# EAGLE design Spectra6PCB_93 (EAGLE 9.6.2)
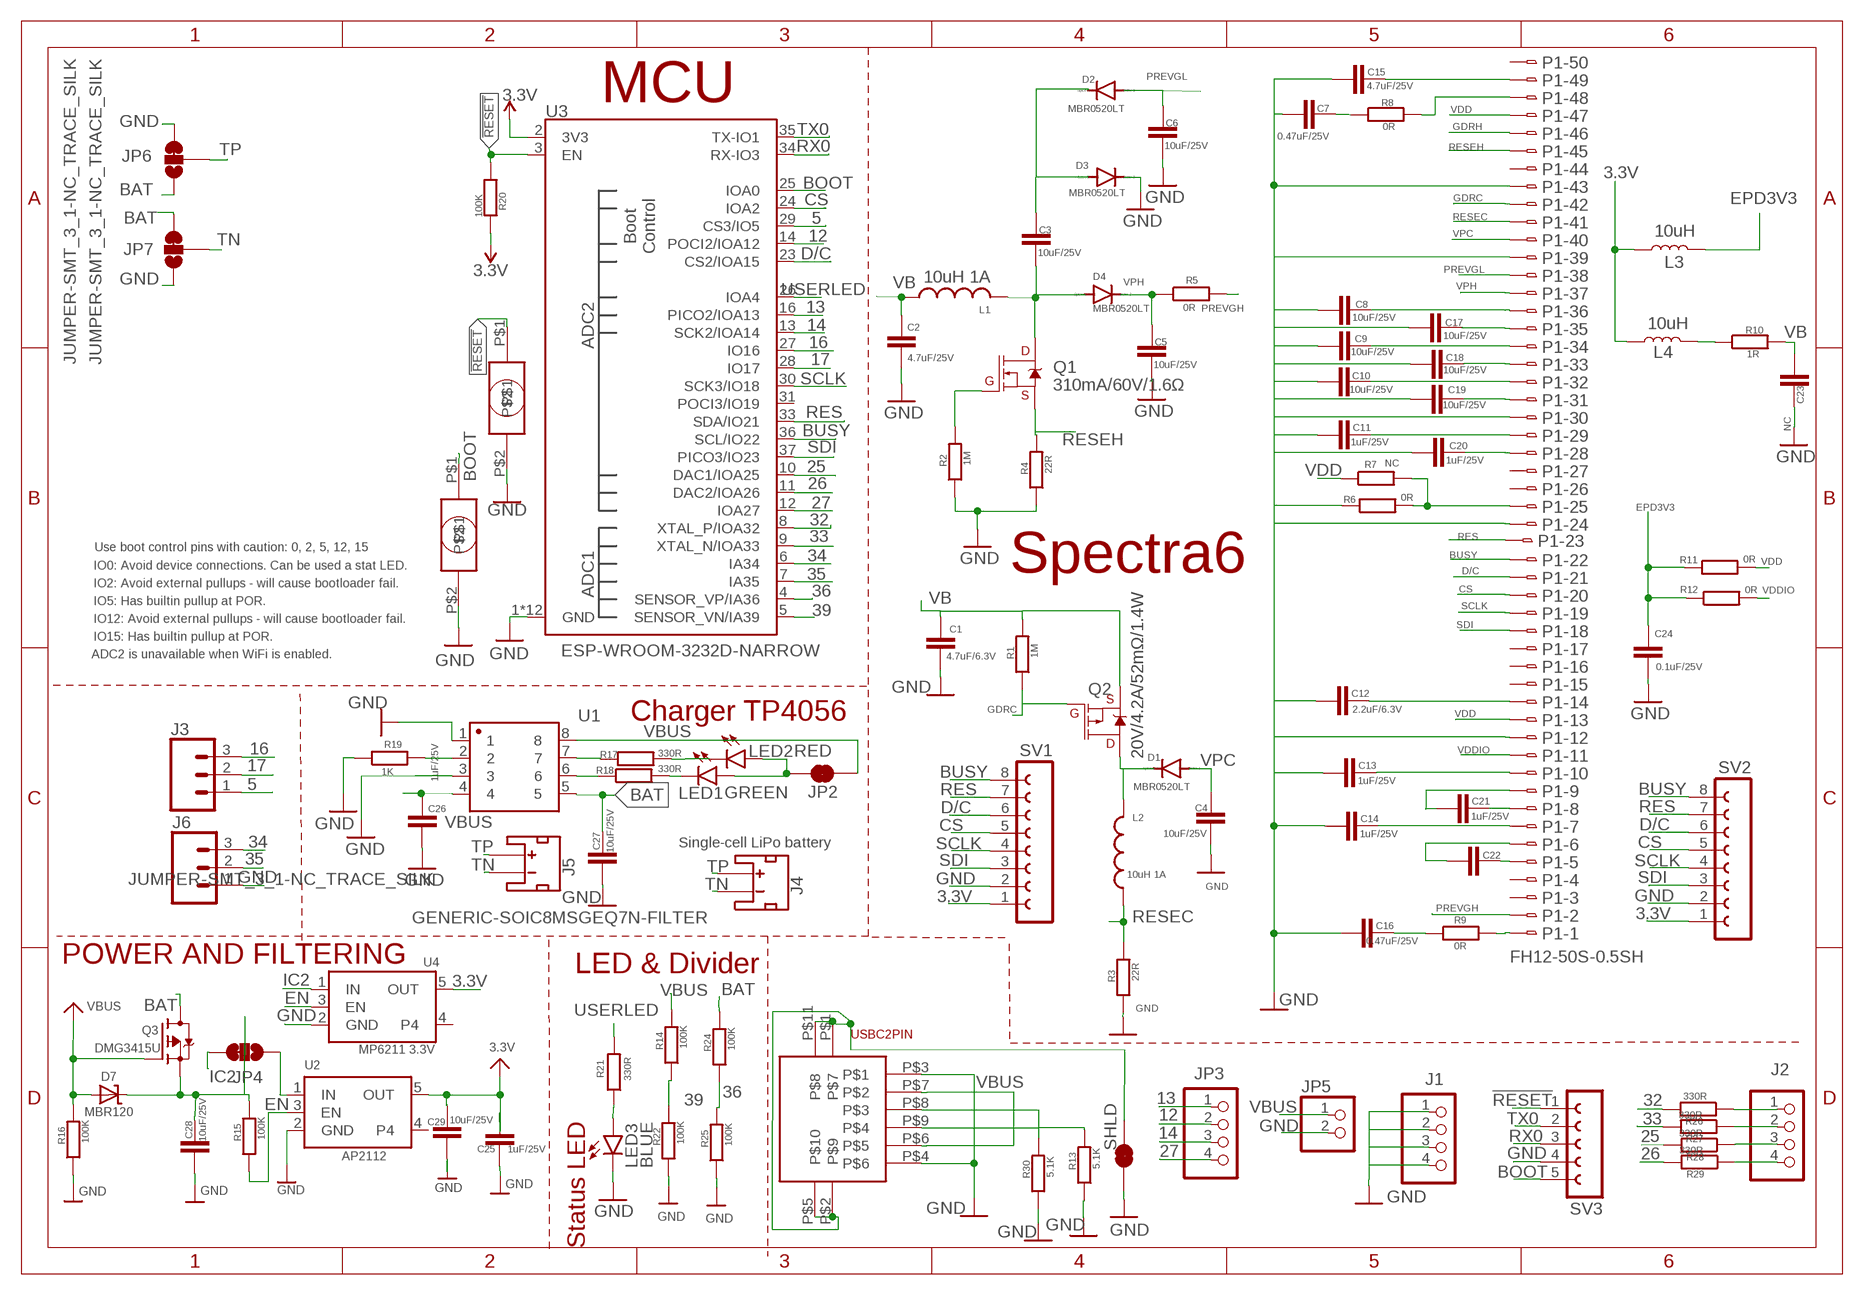
[diagram p0: schematic, sheet 1]

## Parts
C1  4.7uF/6.3V  C-EUC0805  [C0805]
C2  4.7uF/25V  C-EUC0805  [C0805]
C3  10uF/25V  C-EUC0805  [C0805]
C4  10uF/25V  C-EUC0805  [C0805]
C5  10uF/25V  C-EUC0805  [C0805]
C6  10uF/25V  C-EUC0805  [C0805]
C7  0.47uF/25V  C-EUC0805  [C0805]
C8  10uF/25V  C-EUC0805  [C0805]
C9  10uF/25V  C-EUC0805  [C0805]
C10  10uF/25V  C-EUC0805  [C0805]
C11  1uF/25V  C-EUC0805  [C0805]
C12  2.2uF/6.3V  C-EUC0805  [C0805]
C13  1uF/25V  C-EUC0805  [C0805]
C14  1uF/25V  C-EUC0805  [C0805]
C15  4.7uF/25V  C-EUC0805  [C0805]
C16  0.47uF/25V  C-EUC0805  [C0805]
C17  10uF/25V  C-EUC0805  [C0805]
C18  10uF/25V  C-EUC0805  [C0805]
C19  10uF/25V  C-EUC0805  [C0805]
C20  1uF/25V  C-EUC0805  [C0805]
C21  1uF/25V  C-EUC0805  [C0805]
C22  1uF/25V  C-EUC0805  [C0805]
C23  NC  C-EUC0805  [C0805]
C24  0.1uF/25V  C-EUC0805  [C0805]
C25  1uF/25V  C-EUC0805  [C0805]
C26  1uF/25V  C-EUC0805  [C0805]
C27  10uF/25V  C-EUC0805  [C0805]
C28  10uF/25V  C-EUC0805  [C0805]
C29  10uF/25V  C-EUC0805  [C0805]
D1  MBR0520LT  [SOD123]
D2  MBR0520LT  [SOD123]
D3  MBR0520LT  [SOD123]
D4  MBR0520LT  [SOD123]
D7  MBR120  DIODE-SCHOTTKYSOD-123  [SOD-123]
J1  PINHD-1X4  [1X04]
J2  PINHD-1X4  [1X04]
J3  CONN_03PAD  [1X03_SOLDER_PADS]
J4  JST_2MM_MALE  [JST-2-SMD]
J5  NC  JST_2MM_MALE  [JST-2-SMD]
J6  CONN_03PAD  [1X03_SOLDER_PADS]
JP2  JUMPER-SMT_2_NC_TRACE_SILK  [SMT-JUMPER_2_NC_TRACE_SILK]
JP3  PINHD-1X4  [1X04]
JP4  JUMPER-SMT_3_1-NC_TRACE_SILK  [SMT-JUMPER_3_1-NC_TRACE_SILK]
JP5  PINHD-1X2  [1X02]
JP6  JUMPER-SMT_3_1-NC_TRACE_SILK  [SMT-JUMPER_3_1-NC_TRACE_SILK]
JP7  JUMPER-SMT_3_1-NC_TRACE_SILK  [SMT-JUMPER_3_1-NC_TRACE_SILK]
L1  10uH 1A  L-USL4035M  [L4035M]
L2  10uH 1A  L-USL4035M  [L4035M]
L3  10uH  INDUCTOR-0805-3.3UH  [0805]
L4  10uH  INDUCTOR-0805-3.3UH  [0805]
LED1  GREEN  LEDSML0805  [SML0805]
LED2  RED  LEDSML0805  [SML0805]
LED3  BLUE  LEDSML0805  [SML0805]
P1  FH12-50S-0.5SH  [FH12-50S-0.5SH]
Q1  310mA/60V/1.6Ω  MOSFET-NCH-2N7002PW  [SOT323]
Q2  20V/4.2A/52mΩ/1.4W  MOSFET_PCH-DMG2305UX-7  [SOT23-3]
Q3  DMG3415U  MOSFET-P  [SOT23-R]
R1  1M  R-EU_M0805  [M0805]
R2  1M  R-EU_M0805  [M0805]
R3  22R  R-EU_M0805  [M0805]
R4  22R  R-EU_M0805  [M0805]
R5  0R  R-EU_M0805  [M0805]
R6  0R  R-EU_M0805  [M0805]
R7  NC  R-EU_M0805  [M0805]
R8  0R  R-EU_M0805  [M0805]
R9  0R  R-EU_M0805  [M0805]
R10  1R  R-EU_M0805  [M0805]
R11  0R  R-EU_M0805  [M0805]
R12  0R  R-EU_M0805  [M0805]
R13  5.1K  R-EU_M0805  [M0805]
R14  100K  R-EU_M0805  [M0805]
R15  100K  R-EU_M0805  [M0805]
R16  100K  R-EU_M0805  [M0805]
R17  330R  R-EU_M0805  [M0805]
R18  330R  R-EU_M0805  [M0805]
R19  1K  R-EU_M0805  [M0805]
R20  100K  R-EU_M0805  [M0805]
R21  330R  R-EU_M0805  [M0805]
R22  100K  R-EU_M0805  [M0805]
R24  100K  R-EU_M0805  [M0805]
R25  100K  R-EU_M0805  [M0805]
R26  330R  R-EU_M0805  [M0805]
R27  330R  R-EU_M0805  [M0805]
R28  330R  R-EU_M0805  [M0805]
R29  330R  R-EU_M0805  [M0805]
R30  5.1K  R-EU_M0805  [M0805]
S3  TACTILE  [TACTILE]
S4  TACTILE  [TACTILE]
SHLD  SHLD  JUMPER-SMT_2_NC_TRACE_NO-SILK  [SMT-JUMPER_2_NC_TRACE_NO-SILK]
SV1  FE08-1  [FE08]
SV2  FE08-1  [FE08]
SV3  FE05-1  [FE05-1]
U1  GENERIC-SOIC8MSGEQ7N-FILTER  [SO08]
U2  AP2112  VREG_SOT23-5  [SOT23-5]
U3  ESP-WROOM-3232D-NARROW  [ESP-WROOM-32D-NARROW]
U4  MP6211 3.3V  VREG_SOT23-5  [SOT23-5]
U$4  USBC6PIN  [USBC6PIN]

## Nets
3.3V: C25.2 C29.2 L3.1 L4.1 R20.2 SV1.1 SV2.1 U2.5(OUT) U3.2(3V3) U4.5(OUT)
5: J3.1 U3.29(CS3/IO5)
12: JP3.2 U3.14(POCI2/IOA12)
13: JP3.1 U3.16(PICO2/IOA13)
14: JP3.3 U3.13(SCK2/IOA14)
16: J3.3 U3.27(IO16)
17: J3.2 U3.28(IO17)
25: R28.2 U3.10(DAC1/IOA25)
26: R29.2 U3.11(DAC2/IOA26)
27: JP3.4 U3.12(IOA27)
32: R26.2 U3.8(XTAL_P/IOA32)
33: R27.2 U3.9(XTAL_N/IOA33)
34: J6.3 U3.6(IA34)
35: J6.2 U3.7(IA35)
36: R24.1 R25.2 U3.4(SENSOR_VP/IA36)
39: R14.1 R22.2 U3.5(SENSOR_VN/IA39)
!RESET!: R20.1 S4.P$1 SV3.1 U3.3(EN)
BAT: C27.2 JP6.1 JP7.3 Q3.3(D) R24.2 U1.5
BOOT: S3.P$1 SV3.5 U3.25(IOA0)
BUSY: P1.22 SV1.8 SV2.8 U3.36(SCL/IO22)
CS: P1.20 SV1.5 SV2.5 U3.24(IOA2)
D/C: P1.21 SV1.6 SV2.6 U3.23(CS2/IOA15)
EN: R15.1 U2.3(EN) U4.3(EN)
EPD3V3: C24.2 L3.2 R11.1 R12.1
GDRC: P1.42 Q2.1(G) R1.1
GDRH: P1.46 Q1.1(G) R2.2
GND: C1.1 C2.1 C4.1 C5.2 C6.2 C7.1 C8.1 C9.1 C10.1 C11.1 C12.1 C13.1 C14.1 C15.1 C16.1 C17.1 C18.1 C19.1 C20.1 C23.2 C24.1 C25.1 C26.1 C27.1 C28.1 C29.1 D3.C J1.1 J1.2 J1.3 J1.4 J6.1 JP5.2 JP6.3 JP7.1 LED3.C P1.24 P1.30 P1.39 P1.43 R2.1 R3.1 R4.1 R6.1 R13.1 R16.1 R19.1 R22.1 R25.1 R30.1 S3.P$2 S4.P$2 SHLD.1 SV1.2 SV2.2 SV3.4 U1.1 U1.3 U2.2(GND) U3.1(GND) U3.15(GND) U3.38(GND) U3.GND1(GND) U3.GNDT1(GND) U3.GNDT2(GND) U3.GNDT3(GND) U3.GNDT4(GND) U3.GNDT5(GND) U3.GNDT6(GND) U3.GNDT7(GND) U3.GNDT8(GND) U4.2(GND) U$4.P$3 U$4.P$4
IC2: JP4.3 U4.1(IN)
LED1: LED2.C R17.2
LED2: LED1.C R18.2
N$1: C15.2 P1.49
N$2: P1.48 R8.2
N$3: C7.2 R8.1
N$4: L4.2 R10.1
N$5: C8.2 P1.36
N$6: C17.2 P1.35
N$7: C9.2 P1.34
N$8: C18.2 P1.33
N$9: C10.2 P1.32
N$10: C19.2 P1.31
N$12: C11.2 P1.29
N$13: C20.2 P1.28
N$14: P1.25 R6.2 R7.2
N$15: JP2.2 LED1.A LED2.A
N$16: C12.2 P1.14
N$17: C13.2 P1.10
N$18: C21.1 P1.9
N$19: C21.2 P1.8
N$20: C14.2 P1.7
N$21: C22.1 P1.6
N$22: C22.2 P1.5
N$23: P1.1 R9.2
N$24: C16.2 R9.1
N$25: C3.2 D4.A L1.2 Q1.3(D)
N$26: C3.1 D2.C D3.A
N$28: J2.1 R26.1
N$29: P1.12
N$30: J2.2 R27.1
N$31: D1.C L2.2 Q2.3(D)
N$32: J2.3 R28.1
N$33: C1.2 Q2.2(S) R1.2
N$34: R19.2 U1.2
N$35: JP4.1 U2.1(IN)
N$36: C28.2 D7.C JP4.2 Q3.2(S) R15.2
N$37: R18.1 U1.6
N$38: R17.1 U1.7
N$39: LED3.A R21.1
N$40: J2.4 R29.1
N$41: R13.2 U$4.P$9
N$42: R30.2 U$4.P$8
PREVGH: P1.2 R5.2
PREVGL: C6.1 D2.A P1.38
RES: P1.23 SV1.7 SV2.7 U3.33(SDA/IO21)
RESEC: L2.1 P1.41 R3.2
RESEH: P1.45 Q1.2(S) R4.2
RX0: SV3.3 U3.34(RX-IO3)
SCLK: P1.19 SV1.4 SV2.4 U3.30(SCK3/IO18)
SDI: P1.18 SV1.3 SV2.3 U3.37(PICO3/IO23)
SHLD: SHLD.2 U$4.P$1 U$4.P$2 U$4.P$5 U$4.P$11
TN: J4.1(-) J5.1(-) JP7.2
TP: J4.2(+) J5.2(+) JP6.2
TX0: SV3.2 U3.35(TX-IO1)
USERLED: R21.2 U3.26(IOA4)
VB: C2.2 C23.1 L1.1 R10.2
VBUS: C26.2 D7.A JP2.1 JP5.1 Q3.1(G) R14.2 R16.2 U1.4 U1.8 U$4.P$6 U$4.P$7
VDD: P1.13 P1.47 R7.1 R11.2
VDDIO: P1.11 R12.2
VPC: C4.2 D1.A P1.40
VPH: C5.1 D4.C P1.37 R5.1
Unconnected: J4.NC1(PAD1) J4.NC2(PAD2) J5.NC1(PAD1) J5.NC2(PAD2) P1.3 P1.4 P1.15 P1.16 P1.17 P1.26 P1.27 P1.44 P1.50 U2.4 U3.31(POCI3/IO19) U4.4

## Notes on the sheet
- MCU
- Use boot control pins with caution: 0, 2, 5, 12, 15
- IO0: Avoid device connections. Can be used a stat LED.
- Spectra6
- IO2: Avoid external pullups - will cause bootloader fail.
- IO5: Has builtin pullup at POR.
- IO12: Avoid external pullups - will cause bootloader fail.
- IO15: Has builtin pullup at POR.
- ADC2 is unavailable when WiFi is enabled.
- Charger TP4056
- Single-cell LiPo battery
- POWER AND FILTERING
- LED & Divider
- Status LED

## Library data of the parts
C1-C29 = rcl:C-EU: CAPACITOR, European symbol; SPICEPREFIX: C
D1-D4 = diode:MBR0520LT: SCHOTTKY BARRIER RECTIFIER Source: http://onsemi.com .. MBR0520LT1-D.pdf
D7 = microbuilder:DIODE-SCHOTTKY
J1 J2 JP3 = pinhead:PINHD-1X4: PIN HEADER
J3 J6 = SparkFun-Connectors:CONN_03: Multi connection point. Often used as Generic Header-pin footprint for 0.1 inch spaced/style header connections On any of the 0.1 inch spaced packages, you can populate with these: Break Away Headers - Straight <https://www.sparkfun.com/products/116> (PRT-00116) Break Away Male Headers - Right Angle <https://www.sparkfun.com/products/553> (PRT-00553) Female Headers <https://www.sparkfun.com/products/115> (PRT-00115) Break Away Headers - Machine Pin <https://www.sparkfun.com/products/117> (PRT-00117) Break Away Female Headers - Swiss Machine Pin <https://www.sparkfun.com/products/743> (PRT-00743) Stackable Header - 3 Pin (Female, 0.1") <https://www.sparkfun.com/products/13875> (PRT-13875) For SCREWTERMINALS and SPRING TERMINALS visit here: Screw Terimnals on SparkFun.com <https://www.sparkfun.com/search/results?term=Screw+Terminals> (5mm/3.5mm/2.54mm spacing) This device is also useful as a general connection point to wire up your design to another part of your project. Our various solder wires solder well into these plated through hole pads. Hook-Up Wire - Assortment (Stranded, 22 AWG) <https://www.sparkfun.com/products/11375> (PRT-11375) Hook-Up Wire - Assortment (Solid Core, 22 AWG) <https://www.sparkfun.com/products/11367> (PRT-11367) View the entire wire category on our website here <https://www.sparkfun.com/categories/141> Special notes: Molex polarized connector foot print use with SKU : PRT-08232 with associated crimp pins and housings.
J4 J5 = SparkFun-Connectors:JST_2MM_MALE: JST 2MM MALE RA CONNECTOR Two pin, compact surface mount connector. Commonly used as a battery input connection point. We really like the solid locking feeling and high current rating on these small connectors. We use these all the time as battery connectors. Mates to single-cell LiPo batteries. Here is the connector we sell at SparkFun: JST Right Angle Connector - White <https://www.sparkfun.com/products/8612> (PRT-08612) Datasheet <http://www.sparkfun.com/datasheets/Prototyping/Connectors/JST-Horizontal.pdf> It was used on these SparkFun products: SparkFun MOSFET Power Controller <https://www.sparkfun.com/products/11214> (PRT-11214) SparkFun Battery Babysitter - LiPo Battery Manager <https://www.sparkfun.com/products/13777> (PRT-13777) And many, many others that required a lipo battery connection.; PROD_ID: CONN-11443; SF_ID: PRT-08612
JP2 SHLD = SparkFun-Jumpers:JUMPER-SMT_2_NC_TRACE: Normally closed trace jumper This jumper has a trace between two pads so it's normally closed (NC). Use a razor knife to open the connection. For best results follow the IPC guidelines for cutting traces: Cutout at least 0.063 mm (0.005 in). Remove all loose material to clean up the cut area. Seal the cut with an approved epoxy. Reapply solder to reclose the connection.
JP4 JP6 JP7 = SparkFun-Jumpers:JUMPER-SMT_3_1-NC_TRACE: Normally closed trace jumper (1 of 2 connections) This jumper has a trace between two pads so it's normally closed (NC). The other connection is normally open (NO). Use a razor knife to open the connection. For best results follow the IPC guidelines for cutting traces: Cutout at least 0.063 mm (0.005 in). Remove all loose material to clean up the cut area. Seal the cut with an approved epoxy. Reapply solder to reclose the connection, or to close the NO connection.
JP5 = pinhead:PINHD-1X2: PIN HEADER
L1 L2 = rcl:L-US: INDUCTOR, American symbol; SPICEPREFIX: L
L3 L4 = SparkFun-Coils:INDUCTOR: Inductors Resist changes in electrical current. Basically a coil of wire. SparkFun Products: SparkFun Load Cell Amplifier - HX711 <https://www.sparkfun.com/products/13879> IOIO-OTG - V2.2 <https://www.sparkfun.com/products/13613>; PROD_ID: NDUC-13076; VALUE: 3.3µH/±20%/450mA
LED1-LED3 = led:LED: LED OSRAM: - CHIPLED LG R971, LG N971, LY N971, LG Q971, LY Q971, LO R971, LY R971 LH N974, LH R974 LS Q976, LO Q976, LY Q976 LO Q996 - Hyper CHIPLED LW Q18S LB Q993, LB Q99A, LB R99A - SideLED LS A670, LO A670, LY A670, LG A670, LP A670 LB A673, LV A673, LT A673, LW A673 LH A674 LY A675 LS A676, LA A676, LO A676, LY A676, LW A676 LS A679, LY A679, LG A679 - Hyper Micro SIDELED® LS Y876, LA Y876, LO Y876, LY Y876 LT Y87S - SmartLED LW L88C, LW L88S LB L89C, LB L89S, LG L890 LS L89K, LO L89K, LY L89K LS L896, LA L896, LO L896, LY L896 - TOPLED LS T670, LO T670, LY T670, LG T670, LP T670 LSG T670, LSP T670, LSY T670, LOP T670, LYG T670 LG T671, LOG T671, LSG T671 LB T673, LV T673, LT T673, LW T673 LH T674 LS T676, LA T676, LO T676, LY T676, LB T676, LH T676, LSB T676, LW T676 LB T67C, LV T67C, LT T67C, LS T67K, LO T67K, LY T67K, LW E67C LS E67B, LA E67B, LO E67B, LY E67B, LB E67C, LV E67C, LT E67C LW T67C LS T679, LY T679, LG T679 LS T770, LO T770, LY T770, LG T770, LP T770 LB T773, LV T773, LT T773, LW T773 LH T774 LS E675, LA E675, LY E675, LS T675 LS T776, LA T776, LO T776, LY T776, LB T776 LHGB T686 LT T68C, LB T68C - Hyper Mini TOPLED® LB M676 - Mini TOPLED Santana® LG M470 LS M47K, LO M47K, LY M47K Source: http://www.osram.convergy.de LUXEON: - LUMILED® LXK2-PW12-R00, LXK2-PW12-S00, LXK2-PW14-U00, LXK2-PW14-V00 LXK2-PM12-R00, LXK2-PM12-S00, LXK2-PM14-U00 LXK2-PE12-Q00, LXK2-PE12-R00, LXK2-PE12-S00, LXK2-PE14-T00, LXK2-PE14-U00 LXK2-PB12-K00, LXK2-PB12-L00, LXK2-PB12-M00, LXK2-PB14-N00, LXK2-PB14-P00, LXK2-PB14-Q00 LXK2-PR12-L00, LXK2-PR12-M00, LXK2-PR14-Q00, LXK2-PR14-R00 LXK2-PD12-Q00, LXK2-PD12-R00, LXK2-PD12-S00 LXK2-PH12-R00, LXK2-PH12-S00 LXK2-PL12-P00, LXK2-PL12-Q00, LXK2-PL12-R00 Source: www.luxeon.com KINGBRIGHT: KA-3528ASYC Source: www.kingbright.com
P1 = con-hirose:FH12-50S-0.5S: 0.5mm Pitch Connectors For FPC/FFC Source: Data sheet <http://www.hirose.co.jp/cataloge_hp/e58605370.pdf>; MPN: FH12-50S-0.5SH(55); OC_FARNELL: 1324557; OC_NEWARK: 34M6181
Q1 = SparkFun-DiscreteSemi:MOSFET-NCH: N-channel MOSFETs Voltage controlled devices that allow control of high current outputs. SparkFun Products: SparkFun OpenScale <https://www.sparkfun.com/products/13261> SparkFun Digital Sandbox <https://www.sparkfun.com/products/12651> SparkFun Monster Moto Shield <https://www.sparkfun.com/products/10182> SparkFun MOSFET Power Controller <https://www.sparkfun.com/products/11214>; PROD_ID: TRANS-11151
Q2 = SparkFun-DiscreteSemi:MOSFET_PCH: P-channel MOSFETs Voltage controlled devices that allow control of high current outputs. SparkFun Products: SparkFun ESP32 Thing <https://www.sparkfun.com/products/13907> SparkFun ESP8266 Thing <https://www.sparkfun.com/products/13231> SparkFun Pi Servo HAT V2 <https://www.sparkfun.com/products/15316> DMG2305UX-7 (20V/4.2A/SOT23-3); PROD_ID: TRANS-14388
Q3 = microbuilder:MOSFET-P: P-Channel Mosfet LEGEND VDS: Voltage Drain-Source ID: Drain Current RDS(ON): Drain-Source On-State Resistance VGS(TH): Gate-Source Threshold Voltage CISS: Drain-Source Input Capacitance SOT-23 Name VDS ID RDS(ON) VGS(TH) CISS Order Number IRLML5103 30V 760mA 600 mOhm -- 75pF @ 25V Digikey: IRLML5103PBFCT-ND IRLML6401 12V 4.3A 50 mOhm 950mV @ 250µA 830pF @ 10V Digikey: IRLML6401PBFTR-ND NTR0202PL 20V 400mA 800 mOhm 2.3V @ 250uA 70pF @ 5V Digikey: NTR0202PLT1GOSTR-ND NTR4101PT1G 20V 1.8A 85 mOhm 1.2V @ 250uA 675pF @ 10V Digikey: NTR4101PT1GOSCT-ND DMP2004K 20V 600mA 900 mOhm 1V @ 250uA 175pF @ 16V Digikey: DMP2004KDICT-ND PMV65XP 20V 3.9A 76 mOhm 950mV @ 1mA 725pF @ 20V Digikey: 568-2358-2-ND TO-252 Name VDS ID RDS(ON) VGS(TH) CISS Order Number AOD417 30V 25A 34 mOhm 3V @ 250µA 920pF @ 15V Digikey: 785-1106-2-ND PowerPak Name VDS ID RDS(ON) VGS(TH) CISS Order Number AON7401 30V 12A 14 mOhm 3V @ 250µA 2600pF @ 15V Digikey: 785-1302-1-ND
R1-R22 R24-R30 = rcl:R-EU_: RESISTOR, European symbol; SPICEPREFIX: R
S3 S4 = TACTILE1:TACTILE
SV1 SV2 = con-lsta:FE08-1: FEMALE HEADER; OC_FARNELL: unknown; OC_NEWARK: unknown
SV3 = con-lsta:FE05-1: FEMALE HEADER; OC_FARNELL: unknown; OC_NEWARK: unknown
U1 = SparkFun-Retired:GENERIC-SOIC8: A placeholder for generic narrow & wide SOIC8 foorptints - used on the DIP adapter board. Has strange reference to IC-10141, a Seven Band Graphic Equalizer Display Filter SOIC-8 VFP: IC-10141; PROD_ID: IC-10141
U2 U4 = microbuilder:VREG_SOT23-5: SOT23-5 Fixed Voltage Regulators Part Current Out V Out V In V Dropout θJA (°C/W) TJ (°C) Digikey Part No. ADP121 150mA 3.3V 3.4-5.5V 0.09V @ 150mA -- -- ADP121-AUJZ33R7CT-ND ADP121 150mA 3.0V 3.1-5.5V 0.09V @ 150mA -- -- ADP121-AUJZ30R7CT-ND ADP122 300mA 3.3V 3.4-5.5V 0.085V @ 300mA -- -- ADP122AUJZ-3.3-R7CT-ND ADP1712 300mA 3.3V 3.5-5.5V 0.17V @ 300mA -- -- ADP1712AUJZ-3.3-R7TR-ND AP7311 (Low Cost) 150mA 3.3V 3.5-6V 0.15V @ 150mA -- -- AP7311-33WG-7DICT-ND LD39015M18R 150mA 1.8V 1.9V-5.5V 0.08V @ 100mA -- -- 497-6977-1-ND LP2985A-33DBVR 150mA 3.3V 3.3-16V 0.28V @ 150mA 206 150 296-18479-1-ND MCP1824T-3302E/OT 300mA 3.3V 3.5V-6V 0.2V @ 300mA -- -- MCP1824T-3302E/OTCT-ND MIC5205-2.5YM5 TR 150mA 2.5V 2.7-16V 0.165V @ 150mA -- -- 576-1257-2-ND MIC5205-3.0YM5 TR 150mA 3.0V 3.2V-16V 0.165V @ 150mA -- -- 576-1258-2-ND MIC5205-3.3YM5 TR 150mA 3.3V 3.5V-16V 0.165V @ 150mA -- -- 576-1259-2-ND TPS780330220 150mA 3.3V+2.2V 3.6-5.5V 250mV Max -- -- 296-23332-1-ND TDA3663/N1,135 100mA 3.3V 3.5-45V 0.18V @ 50mA -- -- 568-5343-1-ND Max operating temp can be calculated using θJA, TJ (max junction temperature), and power in watts. Set the "Maximum Ambient Temperature" until it reaches TJ ("Max Junction Temperature"), which is the absolute limit for safe use of the regulator: Heat Sink Temperature Calculator <http://www.daycounter.com/Calculators/Heat-Sink-Temperature-Calculator.phtml> For example, With 12V source into a 3.3V LP2985 and a 30mA load, we are dissipating (12V-3.3V) * 0.03A = 0.261W. With a θJA of 206 °C/W, a TJ of 150°C, and 261mW we can safely use the chip without a heat sink up to 75°C (=147.1°C Junction Temperature).
U3 = SparkFun-RF:ESP-WROOM-32: ESP-WROOM-32D - trace antenna (includes keepout) ESP-WROOM-32U - U.FL antenna connector Includes both "standard" footprints and "narrow" version (for use with tighter layouts).; PROD_ID: IC-15676
U$4 = USBC6PIN2:USBC6PIN

## Net classes
0 default: width 0.127 mm, drill 0.305 mm
1 power: width 0.305 mm, drill 0.305 mm

## Board
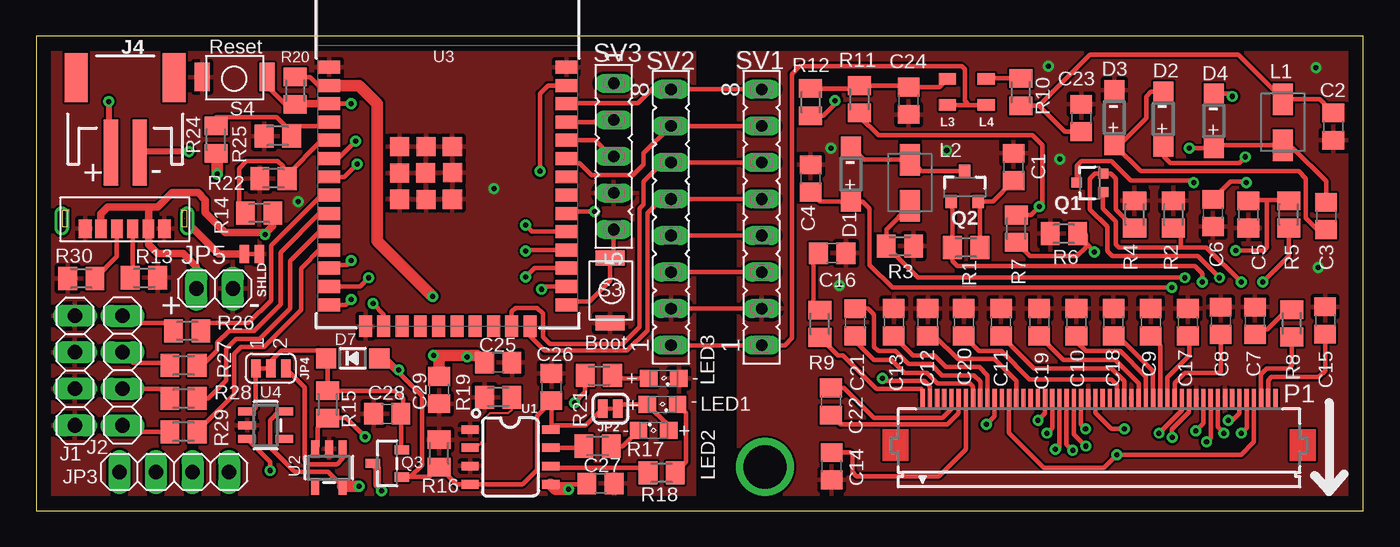
[diagram p1: board, top side]
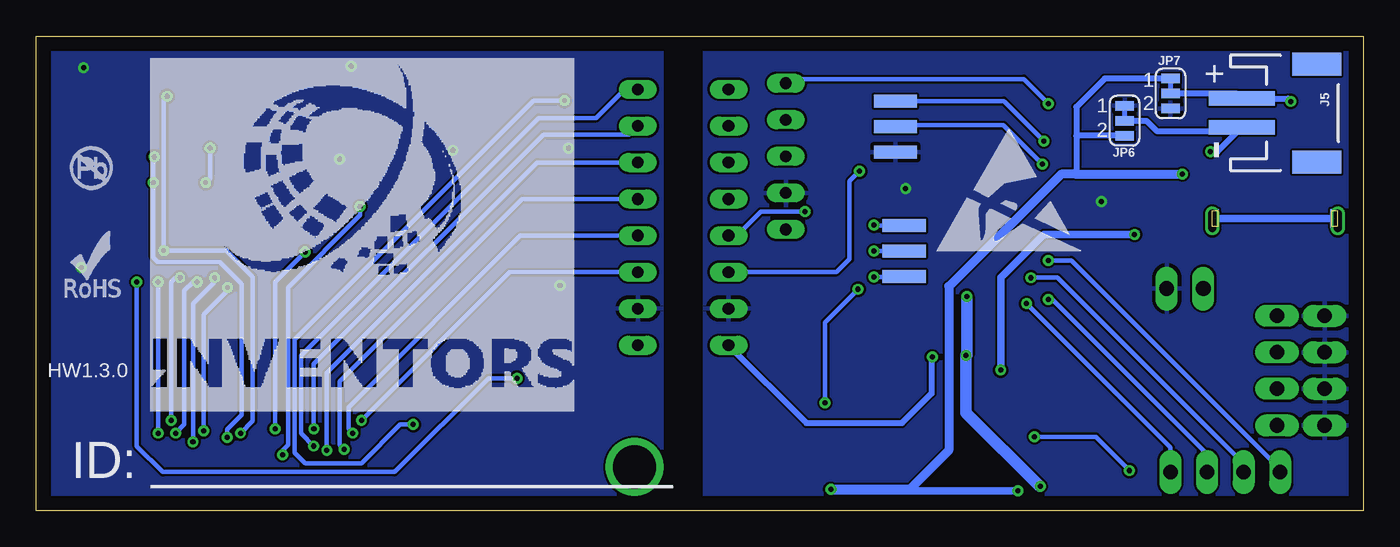
[diagram p2: board, bottom side, seen from below]

Size 92.2 x 33 mm. Coordinates in mm from the lower left corner, seen from the top.
Outline: 0,0 92.2,0 92.2,33 0,33 0,0
Copper layers (1*16): Top 0.035mm / dielectric 1.5mm / Bottom 0.035mm
Design rules "default *": minimum track width 6mil, minimum drill 0.35mm, track to track 6mil, track to pad 6mil, pad to pad 6mil, via to via 6mil, smd to smd 6mil, copper to edge 40mil, drill to drill 6mil, minimum pad ring 10mil, minimum via ring 8mil, stop-mask expansion 4mil, vias tented up to drill 0mil, thermal gap 10mil

### Footprints (pad centres in the part's own frame; a part is rotated, then mirrored left to right if it is on the bottom)
C0805 = smd 1.3 x 1.5: 1 -0.95,0; 2 0.95,0
SOD123 = smd 1.4 x 1.4: A 1.9,0; C -1.9,0
SOD-123 = smd 1.4 x 1.4: A 1.85,0; C -1.85,0
1X04 = drill 1.016 long: 1 -3.81,0; 2 -1.27,0; 3 1.27,0; 4 3.81,0
1X03_SOLDER_PADS = smd 3 x 0.9: 1 0,1.778; 2 0,0; 3 0,-1.778
JST-2-SMD = smd 1 x 4.6: 1 -1,-3.7; 2 1,-3.7 | smd 1.6 x 3.4: NC1 -3.4,1.5; NC2 3.4,1.5
SMT-JUMPER_2_NC_TRACE_SILK = smd 0.66 x 1.27: 1 -0.521,0; 2 0.521,0
SMT-JUMPER_3_1-NC_TRACE_SILK = smd 0.66 x 1.27: 1 -1.041,0; 2 0,0; 3 1.041,0
1X02 = drill 1.016 long: 1 -1.27,0; 2 1.27,0
L4035M = smd 2.2 x 1.4: 1 -1.6,0; 2 1.6,0
0805 = smd 0.8 x 1.2: 1 -0.9,0; 2 0.9,0
SML0805 = smd 1.2 x 1.2: A 1.05,0; C -1.05,0
FH12-50S-0.5SH = smd 0.3 x 1.3: 1 -12.25,3.25; 2 -11.75,3.25; 3 -11.25,3.25; 4 -10.75,3.25; 5 -10.25,3.25; 6 -9.75,3.25; 7 -9.25,3.25; 8 -8.75,3.25; 9 -8.25,3.25; 10 -7.75,3.25; 11 -7.25,3.25; 12 -6.75,3.25; 13 -6.25,3.25; 14 -5.75,3.25; 15 -5.25,3.25; 16 -4.75,3.25; 17 -4.25,3.25; 18 -3.75,3.25; 19 -3.25,3.25; 20 -2.75,3.25; 21 -2.25,3.25; 22 -1.75,3.25; 23 -1.25,3.25; 24 -0.75,3.25; 25 -0.25,3.25; 26 0.25,3.25; 27 0.75,3.25; 28 1.25,3.25; 29 1.75,3.25; 30 2.25,3.25; 31 2.75,3.25; 32 3.25,3.25; 33 3.75,3.25; 34 4.25,3.25; 35 4.75,3.25; 36 5.25,3.25; 37 5.75,3.25; 38 6.25,3.25; 39 6.75,3.25; 40 7.25,3.25; 41 7.75,3.25; 42 8.25,3.25; 43 8.75,3.25; 44 9.25,3.25; 45 9.75,3.25; 46 10.25,3.25; 47 10.75,3.25; 48 11.25,3.25; 49 11.75,3.25; 50 12.25,3.25
SOT323 = smd 0.7 x 0.7: 1 -0.65,-0.925; 2 0.65,-0.925; 3 0,0.925
SOT23-3 = smd 0.8 x 0.9: 1 -0.95,-1; 2 0.95,-1; 3 0,1.1
SOT23-R = smd 0.635 x 1.016: 1 -0.95,-1; 2 0.95,-1; 3 0,1
M0805 = smd 1.3 x 1.6: 1 -0.95,0; 2 0.95,0
TACTILE = smd 1.05 x 2: P$1 0,0; P$2 4.5,0
SMT-JUMPER_2_NC_TRACE_NO-SILK = smd 0.66 x 1.27: 1 -0.521,0; 2 0.521,0
FE08 = drill 0.813 long: 1 -8.89,0; 2 -6.35,0; 3 -3.81,0; 4 -1.27,0; 5 1.27,0; 6 3.81,0; 7 6.35,0; 8 8.89,0
FE05-1 = drill 0.813 long: 1 -5.08,0; 2 -2.54,0; 3 0,0; 4 2.54,0; 5 5.08,0
SO08 = smd 0.6 x 1.2: 1 -1.905,-2.8; 2 -0.635,-2.8; 3 0.635,-2.8; 4 1.905,-2.8; 5 1.905,2.8; 6 0.635,2.8; 7 -0.635,2.8; 8 -1.905,2.8
SOT23-5 = smd 0.55 x 1.2: 1 -0.95,-1.3; 2 0,-1.3; 3 0.95,-1.3; 4 0.95,1.3; 5 -0.95,1.3
ESP-WROOM-32D-NARROW = smd 0.9 x 1.5: 1 6.43,8.238; 2 5.16,8.238; 3 3.89,8.238; 4 2.62,8.238; 5 1.35,8.238; 6 0.08,8.238; 7 -1.19,8.238; 8 -2.46,8.238; 9 -3.73,8.238; 10 -5,8.238; 11 -6.27,8.238; 12 -7.54,8.238; 13 -8.81,8.238; 14 -10.08,8.238; 25 -10.08,-8.238; 26 -8.81,-8.238; 27 -7.54,-8.238; 28 -6.27,-8.238; 29 -5,-8.238; 30 -3.73,-8.238; 31 -2.46,-8.238; 32 -1.19,-8.238; 33 0.08,-8.238; 34 1.35,-8.238; 35 2.62,-8.238; 36 3.89,-8.238; 37 5.16,-8.238; 38 6.43,-8.238 | smd 1.5 x 0.9: 15 -11.57,5.715; 16 -11.57,4.445; 17 -11.57,3.175; 18 -11.57,1.905; 19 -11.57,0.635; 20 -11.57,-0.635; 21 -11.57,-1.905; 22 -11.57,-3.175; 23 -11.57,-4.445; 24 -11.57,-5.715 | smd 1.33 x 1.33: GND1 -0.912,1.531; GNDT1 -2.751,3.346; GNDT2 -2.761,1.516; GNDT3 -2.751,-0.314; GNDT4 -0.891,-0.324; GNDT5 0.909,-0.314; GNDT6 0.909,1.516; GNDT7 0.909,3.346; GNDT8 -0.921,3.346
USBC6PIN = smd 0.55 x 1.3: P$1 8.65,1.45; P$2 0.35,1.45 | smd 0.89 x 1.3: P$3 7.25,2.15; P$4 1.75,2.15 | smd 0.55 x 1.3 bottom: P$5 0.35,1.45; P$11 8.65,1.45 | smd 0.79 x 1.3: P$6 2.85,2.15; P$7 6.15,2.15; P$8 5.05,2.15; P$9 3.95,2.15

### Placement (x,y rotation side)
C1  67.9,23.9 270 top
C2  90.1,26.7 90 top
C3  89.6,20.5 90 top
C4  53.8,23.1 270 top
C5  84.2,20.6 270 top
C6  81.74,20.7 270 top
C7  84.66,13.21 270 top
C8  82.28,13.21 270 top
C9  77.42,13.11 270 top
C10  72.26,13.11 270 top
C11  67.02,13.11 270 top
C12  61.93,13.11 270 top
C13  59.58,13.11 270 top
C14  55.26,3.1 90 top
C15  89.53,13.23 270 top
C16  55.3,17.91 180 top
C17  80,13.11 270 top
C18  74.84,13.11 270 top
C19  69.68,13.11 270 top
C20  64.44,13.11 270 top
C21  56.89,13.1 270 top
C22  55.21,7.6 90 top
C23  72.6,27.3 90 top
C24  60.6,28.5 90 top
C25  32.1,10.3 180 top
C26  35.8,8.6 270 top
C27  39.2,1.9 180 top
C28  24.4,6.75 0 top
C29  28,8.4 90 top
D1  56.6,23.4 270 top
D2  78.29,27.23 270 top
D3  74.89,27.33 270 top
D4  81.8,27.1 270 top
D7  22,10.6 0 top
J1  2.7,9.75 90 top
J2  6,9.75 270 top
J3  31.9,18.05 0 bottom
J4  6.2,28.6 0 top
J5  4.75,27.65 270 bottom
J6  32.5,26.7 180 bottom
JP2  39.9,7.1 0 top
JP3  9.6,2.7 180 top
JP4  16.3,9.9 180 top
JP5  12.4,15.45 0 top
JP6  16.59,27.12 90 bottom
JP7  13.4,29 90 bottom
L1  86.6,27 270 top
L2  60.7,22.8 90 top
L3  63.3,29.1 90 top
L4  66,29.1 90 top
LED1  43.5,7.4 180 top
LED2  42.9,5.6 0 top
LED3  43.6,9.2 180 top
P1  73.83,4.57 0 top
Q1  73.2,22.8 90 top
Q2  64.5,22.5 0 top
Q3  24.4,3.3 90 top
R1  64.6,18.3 0 top
R2  79,20.6 270 top
R3  60,18.4 180 top
R4  76.3,20.6 270 top
R5  87,20.6 270 top
R6  71.39,19.26 0 top
R7  68.08,19.61 270 top
R8  87.22,13.03 270 top
R9  54.44,13 270 top
R10  68.4,29.1 270 top
R11  57.2,28.6 270 top
R12  53.8,28.4 270 top
R13  7.5,16.2 180 top
R14  15.5,20.7 0 top
R15  20.25,7.4 90 top
R16  28,4 270 top
R17  39,4.5 0 top
R18  43.45,2.65 0 top
R19  32.1,7.9 0 top
R20  18,29.2 90 top
R21  39.1,9.4 180 top
R22  16.5,23.1 0 top
R24  12.5,25.8 270 top
R25  16.8,26.05 0 top
R26  10.5,12.5 0 top
R27  10.25,10.1 0 top
R28  10.25,7.8 0 top
R29  10.25,5.5 0 top
R30  3.15,16.15 0 top
S3  39.87,17.56 270 top
S4  16.05,30.15 180 top
SHLD  15,17.85 180 top
SV1  50.4,20.4 90 top
SV2  44.1,20.4 90 top
SV3  40.13,24.64 270 top
U1  32.95,3.75 270 top
U2  20.35,3 180 top
U3  28.6,24.4 90 top
U4  15.95,5.95 270 top
U$4  10.67,21.76 180 top
U$5  [ROHS_LOGO_0.18_IN]  90.41,14.73 0 bottom
U$7  [NO_PB_LOGO_0.120]  90.08,21.93 0 bottom
U$8  [ESD_10.00]  29.72,17.95 0 bottom

### Tracks (layer width: path | path; a pad name or v marks a point on that pad's centre or on a via)
3.3V  (via drill 0.35)
  Top 0.305: C25.2 30.75,10.7 28,10.7 | U3.2 19.64,29.56 19.05,30.15 R20.2 | U4.5 16.85,6.9 16.25,6.3 16.25,4.4 17.95,2.7 20.3,2.7 U2.5 | L3.1 64.8,28.2 | 64.8,28.2 L4.1 | 64.8,28.2 64.5,28.5 64.5,30.7 64.3,30.9 53.04,30.9 52.5,30.36 52.5,12 52.01,11.51 SV1.1 SV2.1
  Top 0.406: v29.95,10.7 30.05,10.8 30.65,10.8
  Top 0.8: C29.2 28,10.7
  Top 0.813: U3.2 22.44,29.56 23.7,28.3 23.7,18.75 v27.55,14.9 | v27.6,10.8 30.65,10.8 C25.2 | v22.45,1.7 U2.5
  Bottom 0.406: SV2.1 38.69,6.1 32.05,6.1 30,8.15 30,10.65 v29.95,10.7
  Bottom 0.508: v22.45,1.7 22.48,1.7
  Bottom 0.8: 27.6,6.82 22.48,1.7
  Bottom 0.813: v27.55,14.9 27.55,10.85 v27.6,10.8 27.6,6.82
5  (via drill 0.35)
  Top 0.305: U3.29 34.45,19.4 v34,19.85
  Bottom 0.305: v34,19.85 33.98,19.83 J3.1
12  (via drill 0.35)
  Top 0.305: U3.14 21.52,14.32 v21.9,14.7
  Bottom 0.305: v21.9,14.7 21.6,14.7 10.87,3.97 JP3.2
13  (via drill 0.35)
  Top 0.305: U3.16 24.16,13.64 v23.4,14.4
  Bottom 0.305: v23.4,14.4 13.41,4.41 JP3.1
14  (via drill 0.35)
  Top 0.305: U3.13 20.37,15.6 22.5,15.6 v23.1,16.2
  Bottom 0.305: v23.1,16.2 21.25,16.2 8.33,3.28 JP3.3
16  (via drill 0.35)
  Top 0.305: U3.27 34.61,16.86 v34,16.25
  Bottom 0.305: v34,16.25 31.92,16.25 J3.3
17  (via drill 0.35)
  Top 0.305: U3.28 34.08,18.13 v34,18.05
  Bottom 0.305: v34,18.05 J3.2
25
  Top 0.305: U3.10 19.7,19.4 17.65,17.35 17.65,14.05 15.55,11.95 13.9,11.95 13.2,11.25 13.2,9.05 11.95,7.8 R28.2
26
  Top 0.305: U3.11 20.28,18.21 19.79,18.21 18.4,16.83 18.4,13.95 15.85,11.4 14.25,11.4 13.75,10.9 13.75,8.1 11.22,5.58 11.3,5.5 | 11.35,5.45 11.3,5.5 | R29.2 11.3,5.5
27  (via drill 0.35)
  Top 0.305: U3.12 20.6,17.1 21.6,17.1 v21.9,17.4
  Bottom 0.305: v21.9,17.4 20.3,17.4 5.79,2.89 JP3.4
32
  Top 0.305: U3.8 19.84,21.94 16.34,18.44 16.34,14.64 14.75,13.05 11.8,13.05 11.45,12.7 R26.2
33
  Top 0.305: U3.9 20.28,20.75 19.79,20.75 17,17.97 17,14.35 15.15,12.5 13.4,12.5 12.6,11.7 12.6,11.15 11.55,10.1 R27.2
34  (via drill 0.35)
  Top 0.305: U3.6 20.98,24.48 v22.2,25.7
  Bottom 0.305: v22.2,25.7 24.98,28.48 J6.3
35  (via drill 0.35)
  Top 0.305: U3.7 21.41,23.21 v22.3,24.1
  Bottom 0.305: v22.3,24.1 25,26.8 32.4,26.8 J6.2
36
  Top 0.305: 20.34,27 U3.4 20.06,26.72 17.73,26.72 | 17.73,26.72 17.75,26.7 R25.2 | R24.1 12.5,27.35 16.7,27.35 17.33,26.72 17.73,26.72
39
  Top 0.305: U3.5 19.85,25.75 17.45,23.35 R22.2 17.15,23.4 17.15,23.95 16.8,24.3 14.6,24.3 14.1,23.8 14.1,21.05 R14.1
!RESET!  (via drill 0.35)
  Top 0.305: U3.3 v21.89,28.29 v21.9,28.3 | R20.1 17.3,28.25 16.05,29.5 S4.P$1
  Top 0.508: R20.1 18.04,28.29 U3.3
  Bottom 0.305: v21.9,28.3 23.6,30 39.96,30 40.13,29.83 SV3.1
BAT  (via drill 0.35)
  Top 0.305: U1.5 38.2,1.84 C27.2
  Top 0.508: Q3.3 23.7,3 23.7,1.8 24,1.5 v24,1.39
  Top 0.813: R24.2 12.58,24.77 v12.58,23.4 | v37,1.5 36.09,1.5 U1.5
  Bottom 0.406: 19.95,26.07 19.95,28.06 17.97,30.04 JP7.3 | 19.95,26.07 19.95,23.4 | JP6.1 19.95,26.07 | 19.95,26.07
  Bottom 0.508: v24,1.39 36.89,1.39 v37,1.5
  Bottom 0.61: v12.58,23.4 19.95,23.4 21,23.4 28.8,15.6 28.8,4.2 31.5,1.5 v37,1.5
BOOT
  Top 0.305: U3.25 37.07,14.55 38.45,14.55 39.87,15.96 S3.P$1 40.13,17.82 SV3.5
BUSY  (via drill 0.35)
  Top 0.305: SV1.8 SV2.8 43.99,29.4 42.9,29.4 41.83,28.32 36.87,28.32 U3.36 | P1.22 72.08,5.32 v72.9,4.5 v72.91,4.5
  Bottom 0.305: 72.89,4.5 72.89,4.48 v72.91,4.5 73.79,5.38 73.79,10.8 57.29,27.3 53.29,27.3 51.3,29.29 SV1.8
CS  (via drill 0.35)
  Top 0.305: P1.20 71.08,4.28 v70.8,4.28 | SV1.5 SV2.5 43.43,21.67 42.46,20.7 42.46,12.55 41.05,11.14 35.31,11.14 34.31,12.14 U3.24
  Bottom 0.305: v70.8,4.28 71.1,4.58 71.1,9 58.43,21.67 SV1.5
D/C  (via drill 0.35)
  Top 0.305: P1.21 71.58,4.62 v72,4.2 | SV1.6 SV2.6 | U3.23 33.05,13.85 33.3,14.1 34.8,14.1 35.2,13.7 35.2,12.1 35.7,11.6 40.74,11.6 41.91,12.78 41.91,21 42.2,21.29 42.2,22.89 43.53,24.21 SV2.6 | SV2.6 44.1,23.7
  Bottom 0.305: v72,4.2 72,9.6 57.39,24.21 SV1.6
EN  (via drill 0.35)
  Top 0.305: U2.3 19.55,4.45 19.55,5.75 R15.1 21.55,6.45 v22.85,5.15 | U4.3 16.25,3.4 v16.25,2.8
  Bottom 0.305: v16.25,2.8 18.6,5.15 v22.85,5.15
EPD3V3
  Top 0.305: R12.1 57,29.35 R11.1 60.5,29.55 C24.2 62.75,29.45 L3.2
GDRC  (via drill 0.35)
  Top 0.305: P1.42 82.08,5.82 v82.5,5.4 | v81,15.9 81,16.5 80.5,17 64,17 63.65,17.35 R1.1 | R1.1 63.35,18.6 | Q2.1 63.65,21.4 R1.1
  Bottom 0.305: v82.5,5.4 81.9,6 81.9,15.3 81.3,15.9 v81,15.9
GDRH  (via drill 0.35)
  Top 0.305: P1.46 84.08,5.78 v83.7,5.4 | v83.7,15.9 81.3,18.3 79.5,18.3 | R2.2 79.5,19.15 79.5,18.3 | Q1.1 74.1,22.12 74.1,21 75,20.1 75,18.5 75.2,18.3 79.5,18.3
  Bottom 0.305: v83.7,5.4 v83.7,15.9
GND  (via drill 0.35)
  Top 0.305: SV1.2 SV2.2
  other vias: 55.2,25.2 18.2,21.5 31.8,22.4 63.25,25.05 70.3,30.9 71.1,24.45 55.8,15.65 89.05,16.9 88.9,30.8
  pour Top: -0.6,33.3 -0.6,-0.18 45.7,-0.18 45.7,33.3
  pour Bottom: -0.8,33.9 45.75,33.9 45.75,-0.52 -0.8,-0.52
  pour Bottom: 48.75,33.82 93.66,33.82 93.66,-0.6 48.75,-0.6
  pour Top: 48.83,33.36 48.83,-0.2 93.09,-0.2 93.09,33.36
IC2
  Top 0.305: U4.1 15,6.9 15.26,7.16 JP4.3
LED1
  Top 0.305: R17.2 40.75,4.5 LED2.C
LED2
  Top 0.305: LED1.C 45.16,6.79 45.16,3.4 R18.2
N$1
  Top 0.305: P1.49 85.58,9.08 85.8,9.3 89.1,9.3 89.53,9.73 C15.2
N$2
  Top 0.305: P1.48 85.08,9.48 85.5,9.9 87,9.9 87.22,10.12 R8.2
N$3
  Top 0.305: R8.1 87.06,14.14 85.52,12.6 85,12.6 C7.2
N$4
  Top 0.305: L4.2 66.05,30.05 R10.1
N$5
  Top 0.305: P1.36 79.08,8.88 79.8,9.6 82.2,9.6 82.28,9.68 C8.2
N$6
  Top 0.305: P1.35 78.58,9.28 80.1,10.8 80.1,12.06 C17.2
N$7
  Top 0.305: P1.34 78.08,11.5 C9.2
N$8
  Top 0.305: P1.33 77.58,9.72 75.14,12.16 C18.2
N$9
  Top 0.305: P1.32 77.08,9.32 75.3,11.1 72.9,11.1 72.26,11.74 C10.2
N$10
  Top 0.305: P1.31 76.58,8.87 74.95,10.5 71.34,10.5 C19.2
N$12
  Top 0.305: P1.29 75.58,9.02 74.7,9.9 69.3,9.9 67.04,12.16 C11.2
N$13
  Top 0.305: P1.28 75.08,8.76 74.7,9.14 69,9.14 67.04,11.1 65.5,11.1 C20.2 | C20.2 64.89,12.16 | C20.2 64.8,11.8
N$14  (via drill 0.35)
  Top 0.305: R7.2 69.04,17.7 72.3,17.7 72.9,18.3 72.9,18.6 | 72.9,18.6 72.9,19.2 72.84,19.26 R6.2 | P1.25 73.58,6.82 74.7,5.7 v75.6,5.7 | v73.5,18 72.9,18.6
  Bottom 0.305: v75.6,5.7 75.6,15.9 v73.5,18
N$15
  Top 0.305: JP2.2 40.72,7.4 LED1.A 43.95,5.9 LED2.A
N$16
  Top 0.305: P1.14 68.08,9.02 66.56,10.54 64.03,10.54 62.41,12.16 C12.2
N$17
  Top 0.305: P1.10 66.08,9.42 65.51,9.99 63.2,9.99 62.39,10.8 60.9,10.8 59.58,12.12 C13.2
N$18
  Top 0.305: P1.9 65.58,9.01 65.16,9.43 62.91,9.43 62.14,10.2 60.6,10.2 59.7,11.1 58.5,11.1 58.2,11.4 58.2,13.64 57.79,14.05 C21.1
N$19
  Top 0.305: P1.8 65.08,8.65 64.86,8.87 62.62,8.87 61.89,9.6 60.3,9.6 59.4,10.5 58.2,10.5 56.89,11.81 C21.2
N$20
  Top 0.305: P1.7 64.58,4.28 62.7,2.4 57,2.4 56.7,2.7 56.7,3.9 56.55,4.05 C14.2
N$21
  Top 0.305: P1.6 64.08,6.78 63.3,6 55.86,6 C22.1
N$22
  Top 0.305: C22.2 56.11,8.55 58.2,6.46 62.95,6.46 63.58,7.09 P1.5
N$23
  Top 0.305: P1.1 61.58,8.37 61.48,8.47 58.38,8.47 56.05,10.8 55.69,10.8 R9.2
N$24
  Top 0.305: C16.2 54,17.56 54,14.1 54.15,13.95 R9.1
N$25  (via drill 0.35)
  Top 0.305: C3.2 89.6,22.9 87.3,25.2 86.8,25.2 L1.2 82,25.4 D4.A v80.1,25.2 | v80.4,22.8 80.25,22.95 76.05,22.95 74.7,24.3 72.6,24.3 72.28,23.98 Q1.3
  Bottom 0.305: v80.4,22.8 80.1,23.1 v80.1,25.2
N$26
  Top 0.305: C3.1 89,19.55 88.2,20.35 88.2,23.1 87.7,23.6 76.72,23.6 D3.A 75.23,25.43 77.1,27.3 77.1,28.8 77.43,29.13 D2.C
N$27  (via drill 3)
  other vias: 50.63,3.05
N$28
  Top 0.305: J2.1 6.29,13.56 6.8,13.05 9.65,13.05 9.65,12.6 R26.1
N$30
  Top 0.305: R27.1 9.13,10.27 6.75,10.27 J2.2
N$31
  Top 0.305: D1.C 57.5,24.4 L2.2 61.5,23.6 Q2.3
N$32
  Top 0.305: J2.3 8.62,8.48 R28.1
N$33
  Top 0.305: 67.75,22.8 C1.2 66.45,21.5 Q2.2 65.55,21.4 R1.2
N$34
  Top 0.152: U1.2 30.36,4.6 30.8,4.6 31.05,4.85 31.05,6.3 31.55,6.8 32.8,6.8 33.05,7.05 R19.2
  Top 0.305: U1.2 30.25,4.49
N$35
  Top 0.305: U2.1 21.3,3.64 20.91,3.25 18.95,3.25 18.65,3.55 18.65,8.59 JP4.1
N$36
  Top 0.305: Q3.2 25.35,4.3 C28.2 25.5,6.9 25.5,7.8 24.95,8.35 R15.2 | R15.2 20.25,10.5 D7.C 19.6,11.15 17.05,11.15 16.3,10.4 JP4.2 | 19.85,8.35 R15.2
N$37
  Top 0.305: U1.6 35.87,3 42.15,3 R18.1
N$38
  Top 0.305: U1.7 37.94,4.38 R17.1
N$39
  Top 0.305: LED3.A 40.25,9.2 R21.1
N$40
  Top 0.305: R29.1 6.44,5.5 J2.4
N$41
  Top 0.305: U$4.P$9 6.72,16.37 R13.2
N$42
  Top 0.305: R30.2 5.62,17.67 U$4.P$8
N$47  (via drill 0.55)
  other vias: 10.5,20.66
N$48  (via drill 0.55)
  other vias: 10.5,20.57
N$49  (via drill 0.55)
  other vias: 10.5,20.49
N$50  (via drill 0.55)
  other vias: 10.5,20.4
N$51  (via drill 0.55)
  other vias: 10.5,20.32
N$52  (via drill 0.55)
  other vias: 10.5,20.23
N$53  (via drill 0.55)
  other vias: 10.5,20.15
N$54  (via drill 0.55)
  other vias: 10.5,20.06
N$55  (via drill 0.55)
  other vias: 10.5,19.98
N$56  (via drill 0.55)
  other vias: 10.5,19.89
N$57  (via drill 0.55)
  other vias: 10.5,19.81
N$58  (via drill 0.55)
  other vias: 10.5,19.73
N$59  (via drill 0.55)
  other vias: 10.5,19.64
N$66  (via drill 0.55)
  other vias: 1.78,20.66
N$67  (via drill 0.55)
  other vias: 1.78,20.57
N$68  (via drill 0.55)
  other vias: 1.78,20.49
N$69  (via drill 0.55)
  other vias: 1.78,20.4
N$70  (via drill 0.55)
  other vias: 1.78,20.32
N$71  (via drill 0.55)
  other vias: 1.78,20.23
N$72  (via drill 0.55)
  other vias: 1.78,20.15
N$73  (via drill 0.55)
  other vias: 1.78,20.06
N$74  (via drill 0.55)
  other vias: 1.78,19.98
N$75  (via drill 0.55)
  other vias: 1.78,19.89
N$76  (via drill 0.55)
  other vias: 1.78,19.81
N$77  (via drill 0.55)
  other vias: 1.78,19.73
N$78  (via drill 0.55)
  other vias: 1.78,19.64
PREVGH  (via drill 0.35)
  Top 0.305: v58.8,9.22 58.97,9.04 61.69,9.04 62.08,8.65 P1.2 | v85.2,15.9 87,17.7 R5.2
  Bottom 0.305: v58.8,9.22 60.78,9.22 67.3,2.7 83.4,2.7 85.2,4.5 v85.2,15.9
PREVGL  (via drill 0.35)
  Top 0.305: P1.38 80.08,6.83 78.9,5.65 v78.9,5.11 v78.91,5.1 | v84.05,22.82 84,22.87 82.96,22.87 C6.1 | v84,24.6 83.56,24.16 78.8,24.16 78.34,24.62 78.34,25.28 D2.A
  Bottom 0.305: v78.91,5.1 78.91,5.65 77.9,6.66 77.9,15.75 79.45,17.3 83.75,17.3 84.05,17.6 v84.05,22.82 | 84.05,22.9 v84.05,22.82 | v84,24.6 84.05,24.55 v84.05,22.82
RES  (via drill 0.35)
  Top 0.305: P1.23 72.58,6.02 v72.9,5.7 | SV1.7 SV2.7 42.2,24.85 42.2,24.07 41.46,23.33 38.58,23.33 37.74,24.18 37.14,24.18 U3.33
  Bottom 0.305: v72.9,5.7 72.9,10.2 56.95,26.15 51,26.15 SV1.7
RESEC  (via drill 0.35)
  Top 0.305: P1.41 81.58,5.08 v81.3,4.8 | v79.8,16.2 61.25,16.2 R3.2 59.05,19.55 L2.1
  Bottom 0.305: v81.3,4.8 81.3,14.4 79.8,15.9 v79.8,16.2
RESEH  (via drill 0.35)
  Top 0.305: P1.45 83.58,6.78 83.1,6.3 v82.8,6.3 | v82.2,16.2 80.7,17.7 74.75,17.7 74.4,18.05 74.4,19.75 73.2,20.95 73.2,23.1 73.55,23.45 Q1.2 74.65,23.45 75,23.1 75,20.95 R4.2
  Bottom 0.305: v82.8,6.3 82.8,15.9 82.5,16.2 v82.2,16.2
RX0
  Top 0.305: 37.09,25.5 U3.34 38.84,25.75 39.96,24.64 SV3.3
SCLK  (via drill 0.35)
  Top 0.305: P1.19 70.58,6.59 70.58,6.58 70.58,5.78 v70.2,5.4 | SV1.4 SV2.4 | v38.78,20.79 36.95,20.79 U3.30
  Bottom 0.305: v70.2,5.4 70.5,5.7 70.5,7.2 58.57,19.13 SV1.4 | SV2.4 43.51,19.13 41.85,20.79 v38.78,20.79 | v38.78,20.79
SDI  (via drill 0.35)
  Top 0.305: P1.18 70.08,6.78 v69.6,6.3 | SV1.3 SV2.3 | U3.37 35.56,29.56 35,29 v35,23.6
  Bottom 0.305: v69.6,6.3 59.31,16.59 SV1.3 | v35,23.6 35.7,22.9 35.7,17.5 36.6,16.6 SV2.3
SHLD  (2 unrouted)
  Top 0.508: SHLD.2 12.69,17.85 10.49,20.05 10.49,20.22 10.4,20.31 U$4.P$2
  Bottom 0.508: U$4.P$1 U$4.P$2
TN  (via drill 0.35)
  Top 0.406: J4.1 5.05,25.05 v5.05,28.45
  Bottom 0.406: JP7.2 8.8,29 J5.1 5.25,28.65 v5.05,28.45
TP  (via drill 0.35)
  Top 0.406: J4.2 7.26,24.96 v10.62,24.96
  Bottom 0.406: v10.62,24.96 10.14,24.96 J5.2 8.7,26.4 14.37,26.4 15.07,27.1 16.57,27.1 JP6.2
TX0
  Top 0.305: 37.04,26.82 U3.35 39.97,27.02 SV3.2
USERLED  (via drill 0.35)
  Top 0.305: U3.26 35.29,15.59 v35.1,15.4 | v37.4,7.5 38.15,8.25 R21.2
  Bottom 0.305: v35.1,15.4 37.4,13.1 v37.4,7.5
VB
  Top 0.305: C2.2 89.15,28.6 L1.1 83.5,31.7 73.2,31.7 69.65,28.15 | C23.1 71.45,26.35 69.65,28.15 | R10.2 69.65,28.15
VBUS  (via drill 0.35)
  Top 0.305: 24.6,10.2 26.81,7.99 26.81,3.16 26,2.35 Q3.1 27.3,2.35 R16.2 29.2,1.84 U1.4 33.8,1.84 34.8,2.85 34.8,6.6 35.8,7.6 | 24.2,10.6 D7.A | C26.2 35.8,7.6 | JP2.1 39.34,7.1 38.18,5.94 36.04,5.94 U1.8 35.8,5.71 35.8,7.6 | 4.52,20.62 4.5,20.64 | U$4.P$6 7.89,19.68
  Top 0.508: R14.2 16.45,19.8 15.98,19.34 | 15.98,19.34 15.9,19.25 v15.9,19.2 | v25.2,9.78 25.02,9.78 24.6,10.2 24.2,10.6 | 15.98,19.34 13.15,19.34 11.77,20.72 11.77,21.59 11.25,22.1 9.45,22.1 8.46,21.11 7.7,21.11 | JP5.1 11.13,16.97 10.23,17.87 8.46,17.87 7.82,18.51 U$4.P$6 7.82,21 7.7,21.11 | U$4.P$7 4.5,19.62 4.5,20.64 4.99,21.11 7.7,21.11
  Bottom 0.305: 15.71,19.39 v15.9,19.2
  Bottom 0.508: v15.9,19.2 22.2,19.2 25.2,16.2 v25.2,9.78 25.2,9.7
VDD  (via drill 0.35)
  Top 0.305: P1.47 84.58,4.78 83.7,3.9 v75.08,3.9 74.18,3 70,3 67.58,5.42 P1.13 | R7.1 69.09,20.56 v69.68,21.15 69.9,21.37 69.9,25.4 69.2,26.1 58.5,26.1 57.2,27.4 R11.2
  Bottom 0.305: v69.68,21.15 69.68,20.55 74.7,15.53 74.7,4.58 75.08,4.2 v75.08,3.9
VDDIO  (via drill 0.35)
  Top 0.305: P1.11 66.58,6.58 v66,6 | R12.2 54.7,27.45 55.5,28.25 v55.5,28.5
  Bottom 0.305: v55.5,28.5 57.65,28.5 74.24,11.9 74.24,4.04 73.5,3.3 69.6,3.3 66.9,6 v66,6
VPC  (via drill 0.35)
  Top 0.305: P1.40 81.08,6.08 v80.55,5.55 | v78.9,15.52 59.48,15.52 57.9,17.1 57.9,21 57.4,21.5 D1.A 54.45,21.5 C4.2
  Bottom 0.305: v80.55,5.55 80.55,13.65 78.79,15.41 v78.9,15.52
VPH  (via drill 0.35)
  Top 0.305: P1.37 79.58,6.98 v78,5.4 | v83.32,18.1 85.3,18.1 85.5,18.3 85.5,21.6 | 85.5,21.6 86.95,21.6 R5.1 | 85.5,21.6 84.25,21.6 C5.1 | v83.1,28.8 82.9,29 D4.C
  Bottom 0.305: v78,5.4 77.15,6.25 77.15,16.25 79,18.1 v83.32,18.1 83.32,28.58 v83.1,28.8

### Text on the board
tPlace: Reset | - | - | - | + | + | + | - | + | - | + | - | + | Boot | 1 | 2 | + | - | + | - | - | +
bPlace: + | 1 | 2 | 1 | - | 2 | HW1.3.0 | ID: __________________
tNames: S4 | S3